# EAGLE design platform2 (EAGLE 6.4)
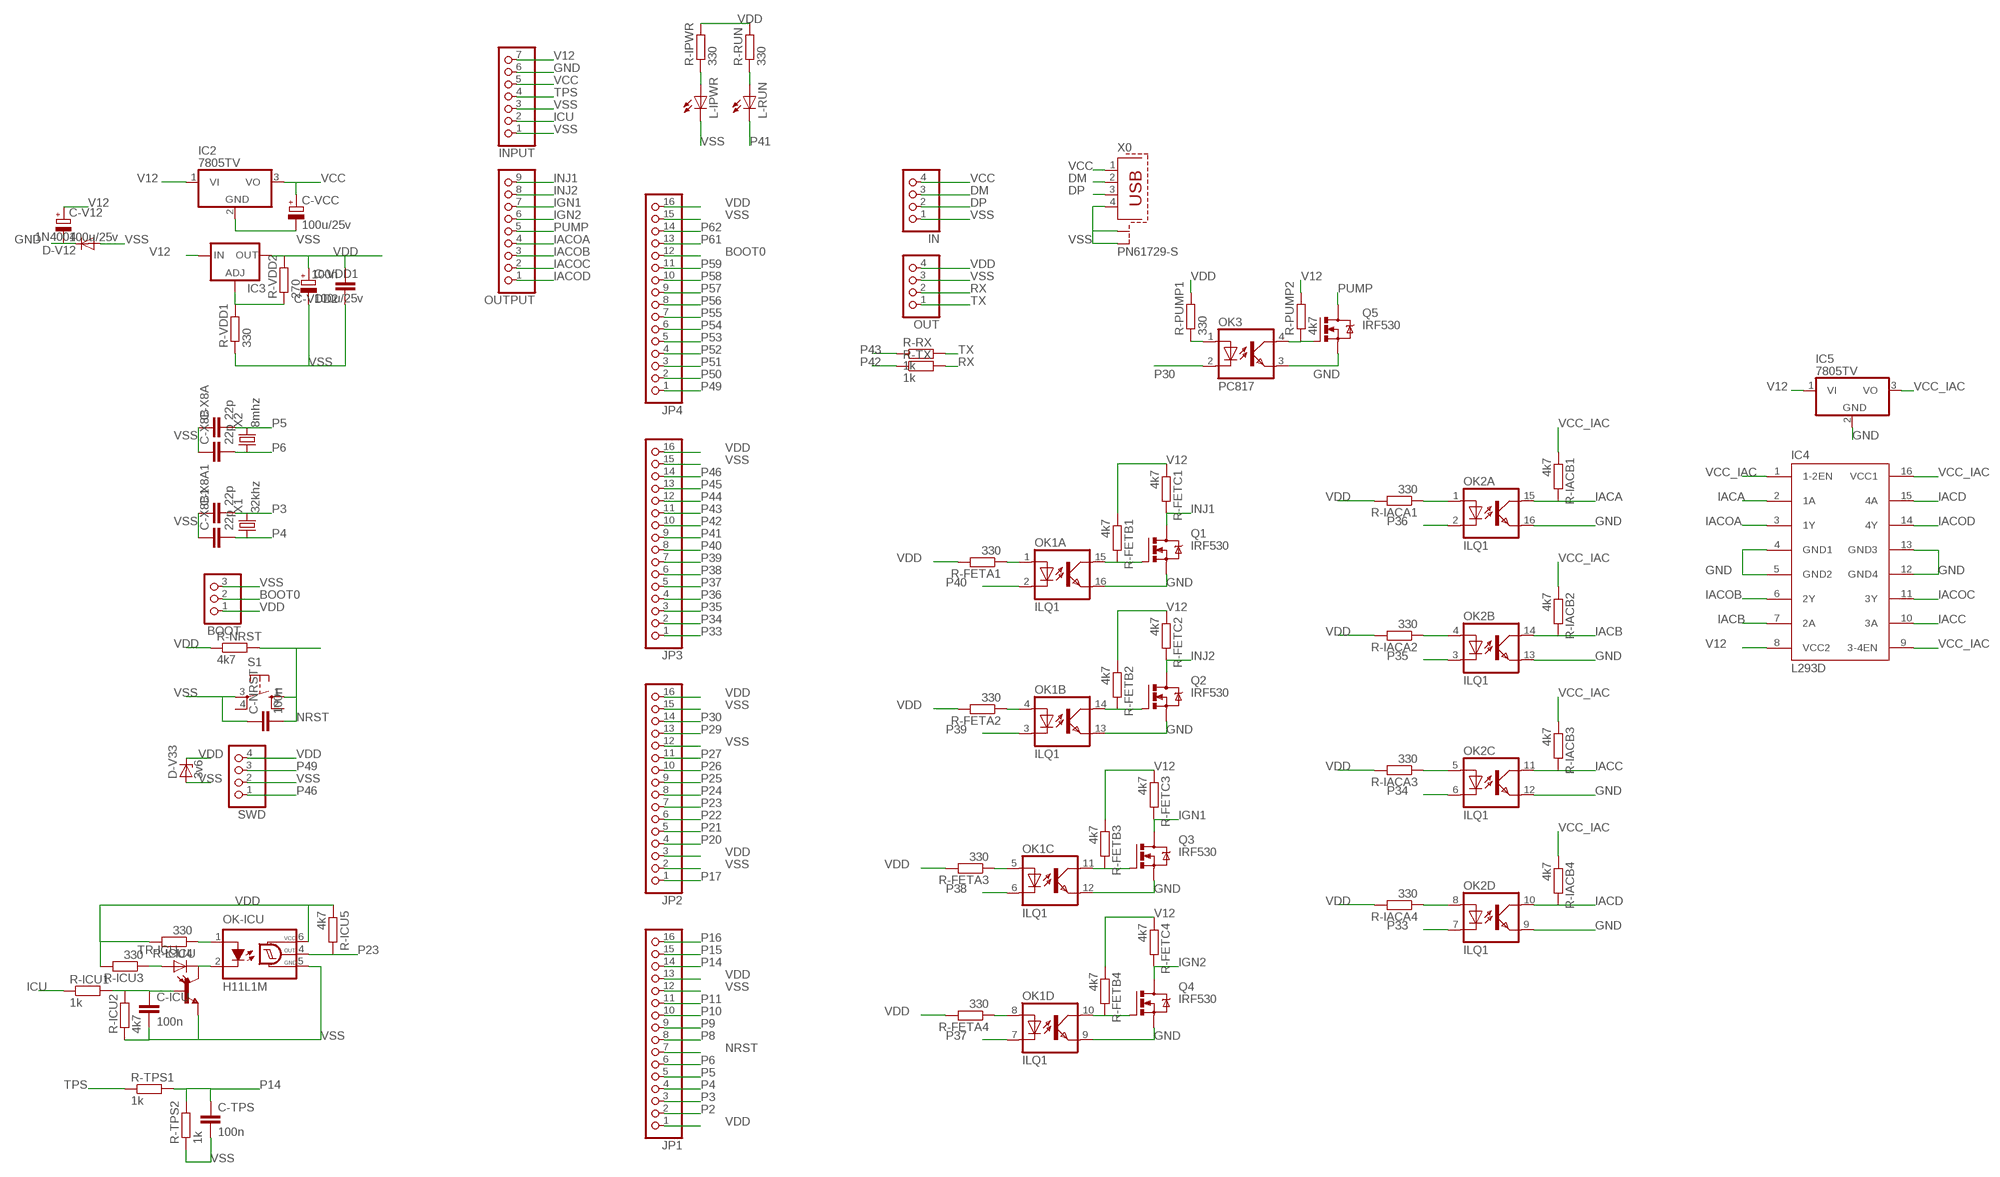
[diagram p0: schematic, sheet 1]

## Parts
BOOT  PINHD-1X3  [1X03]
C-ICU  100n  C-EU050-024X044  [C050-024X044]
C-NRST  100n  C-EU050-024X044  [C050-024X044]
C-TPS  100n  C-EU050-024X044  [C050-024X044]
C-V12  100u/25v  CPOL-EUE2-5  [E2-5]
C-VCC  100u/25v  CPOL-EUE2-5  [E2-5]
C-VDD1  100u/25v  CPOL-EUE2-5  [E2-5]
C-VDD2  100n  C-EU050-024X044  [C050-024X044]
C-X8A  22p  C-EU025-024X044  [C025-024X044]
C-X8A1  22p  C-EU025-024X044  [C025-024X044]
C-X8B  22p  C-EU025-024X044  [C025-024X044]
C-X8B1  22p  C-EU025-024X044  [C025-024X044]
D-V12  1N4004  [DO41-10]
D-V33  3v6  ZENER-DIODEZD-7.5  [ZDIO-7.5]
IC2  7805TV  [TO220V]
IC3  LM317TS  [317TS]
IC4  L293D  [DIL16]
IC5  7805TV  [TO220V]
IN  PINHD-1X4  [1X04]
INPUT  PINHD-1X7  [1X07]
JP1  PINHD-1X16  [1X16]
JP2  PINHD-1X16  [1X16]
JP3  PINHD-1X16  [1X16]
JP4  PINHD-1X16  [1X16]
L-ICU  LED3MM  [LED3MM]
L-IPWR  LED3MM  [LED3MM]
L-RUN  LED3MM  [LED3MM]
OK1  ILQ1  [DIL16]
OK2  ILQ1  [DIL16]
OK3  PC817  [DIL04]
OK-ICU  H11L1M  [DIL06]
OUT  PINHD-1X4  [1X04]
OUTPUT  PINHD-1X9  [1X09]
Q1  IRF530  [TO220BV]
Q2  IRF530  [TO220BV]
Q3  IRF530  [TO220BV]
Q4  IRF530  [TO220BV]
Q5  IRF530  [TO220BV]
R-FETA1  330  R-EU_0204/7  [0204/7]
R-FETA2  330  R-EU_0204/7  [0204/7]
R-FETA3  330  R-EU_0204/7  [0204/7]
R-FETA4  330  R-EU_0204/7  [0204/7]
R-FETB1  4k7  R-EU_0204/7  [0204/7]
R-FETB2  4k7  R-EU_0204/7  [0204/7]
R-FETB3  4k7  R-EU_0204/7  [0204/7]
R-FETB4  4k7  R-EU_0204/7  [0204/7]
R-FETC1  4k7  R-EU_0204/7  [0204/7]
R-FETC2  4k7  R-EU_0204/7  [0204/7]
R-FETC3  4k7  R-EU_0204/7  [0204/7]
R-FETC4  4k7  R-EU_0204/7  [0204/7]
R-IACA1  330  R-EU_0204/7  [0204/7]
R-IACA2  330  R-EU_0204/7  [0204/7]
R-IACA3  330  R-EU_0204/7  [0204/7]
R-IACA4  330  R-EU_0204/7  [0204/7]
R-IACB1  4k7  R-EU_0204/7  [0204/7]
R-IACB2  4k7  R-EU_0204/7  [0204/7]
R-IACB3  4k7  R-EU_0204/7  [0204/7]
R-IACB4  4k7  R-EU_0204/7  [0204/7]
R-ICU1  1k  R-EU_0204/7  [0204/7]
R-ICU2  4k7  R-EU_0204/7  [0204/7]
R-ICU3  330  R-EU_0204/7  [0204/7]
R-ICU4  330  R-EU_0204/7  [0204/7]
R-ICU5  4k7  R-EU_0204/7  [0204/7]
R-IPWR  330  R-EU_0204/7  [0204/7]
R-NRST  4k7  R-EU_0204/7  [0204/7]
R-PUMP1  330  R-EU_0204/7  [0204/7]
R-PUMP2  4k7  R-EU_0204/7  [0204/7]
R-RUN  330  R-EU_0204/7  [0204/7]
R-RX  1k  R-EU_0204/7  [0204/7]
R-TPS1  1k  R-EU_0204/7  [0204/7]
R-TPS2  1k  R-EU_0204/7  [0204/7]
R-TX  1k  R-EU_0204/7  [0204/7]
R-VDD1  330  R-EU_0204/7  [0204/7]
R-VDD2  270  R-EU_0204/7  [0204/7]
S1  10-XX  [B3F-10XX]
SWD  PINHD-1X4  [1X04]
TR-ICU  2N3904-NPN-TO92-EBC  [TO92-EBC]
X0  PN61729-S  [PN61729-S]
X1  32khz  CRYSTALTC26V  [TC26V]
X2  8mhz  CRYSTALHC49U-V  [HC49U-V]

## Nets
BOOT0: BOOT.2 JP4.12
DM: IN.3 X0.2
DP: IN.2 X0.3
GND: C-V12.- D-V12.C IC4.4(GND1) IC4.5(GND2) IC4.12(GND4) IC4.13(GND3) IC5.2(GND) INPUT.6 OK1.9(D:EMIT) OK1.12(C:EMIT) OK1.13(B:EMIT) OK1.16(A:EMIT) OK2.9(D:EMIT) OK2.12(C:EMIT) OK2.13(B:EMIT) OK2.16(A:EMIT) OK3.3(EMIT) Q1.S Q2.S Q3.S Q4.S Q5.S
IACA: IC4.2(1A) OK2.15(A:COL) R-IACB1.2
IACB: IC4.7(2A) OK2.14(B:COL) R-IACB2.2
IACC: IC4.10(3A) OK2.11(C:COL) R-IACB3.2
IACD: IC4.15(4A) OK2.10(D:COL) R-IACB4.2
IACOA: IC4.3(1Y) OUTPUT.4
IACOB: IC4.6(2Y) OUTPUT.3
IACOC: IC4.11(3Y) OUTPUT.2
IACOD: IC4.14(4Y) OUTPUT.1
ICU: INPUT.2 R-ICU1.1
IGN1: OUTPUT.7 Q3.D R-FETC3.2
IGN2: OUTPUT.6 Q4.D R-FETC4.2
INJ1: OUTPUT.9 Q1.D R-FETC1.2
INJ2: OUTPUT.8 Q2.D R-FETC2.2
N$2: OK1.14(B:COL) Q2.G R-FETB2.2
N$3: C-ICU.1 R-ICU1.2 R-ICU2.2 TR-ICU.B
N$4: L-ICU.K(C) OK-ICU.2(C) TR-ICU.C
N$5: OK-ICU.1(A) R-ICU4.1
N$6: L-ICU.A R-ICU3.1
N$7: L-IPWR.A R-IPWR.1
N$8: L-RUN.A R-RUN.1
N$9: OK3.1(A) R-PUMP1.1
N$10: OK2.1(A:A) R-IACA1.1
N$11: OK1.15(A:COL) Q1.G R-FETB1.2
N$12: OK1.4(B:A) R-FETA2.1
N$13: OK1.1(A:A) R-FETA1.1
N$14: OK1.11(C:COL) Q3.G R-FETB3.2
N$15: OK1.5(C:A) R-FETA3.1
N$16: OK1.10(D:COL) Q4.G R-FETB4.2
N$17: OK1.8(D:A) R-FETA4.1
N$18: OK2.4(B:A) R-IACA2.1
N$20: OK3.4(COL) Q5.G R-PUMP2.1
N$21: OK2.5(C:A) R-IACA3.1
N$22: OK2.8(D:A) R-IACA4.1
N$25: IC3.1(ADJ) R-VDD1.2 R-VDD2.1
NRST: C-NRST.2 JP1.7 R-NRST.2 S1.1(S)
P2: JP1.2
P3: C-X8A1.2 JP1.3 X1.2
P4: C-X8B1.2 JP1.4 X1.1
P5: C-X8A.2 JP1.5 X2.2
P6: C-X8B.2 JP1.6 X2.1
P8: JP1.8
P9: JP1.9
P10: JP1.10
P11: JP1.11
P14: C-TPS.1 JP1.14 R-TPS1.2 R-TPS2.2
P15: JP1.15
P16: JP1.16
P17: JP2.1
P20: JP2.4
P21: JP2.5
P22: JP2.6
P23: JP2.7 OK-ICU.4(OUT) R-ICU5.2
P24: JP2.8
P25: JP2.9
P26: JP2.10
P27: JP2.11
P29: JP2.13
P30: JP2.14 OK3.2(C)
P33: JP3.1 OK2.7(D:C)
P34: JP3.2 OK2.6(C:C)
P35: JP3.3 OK2.3(B:C)
P36: JP3.4 OK2.2(A:C)
P37: JP3.5 OK1.7(D:C)
P38: JP3.6 OK1.6(C:C)
P39: JP3.7 OK1.3(B:C)
P40: JP3.8 OK1.2(A:C)
P41: JP3.9 L-RUN.K(C)
P42: JP3.10 R-TX.1
P43: JP3.11 R-RX.1
P44: JP3.12
P45: JP3.13
P46: JP3.14 SWD.1
P49: JP4.1 SWD.3
P50: JP4.2
P51: JP4.3
P52: JP4.4
P53: JP4.5
P54: JP4.6
P55: JP4.7
P56: JP4.8
P57: JP4.9
P58: JP4.10
P59: JP4.11
P61: JP4.13
P62: JP4.14
PUMP: OUTPUT.5 Q5.D
RX: OUT.2 R-TX.2
TPS: INPUT.4 R-TPS1.1
TX: OUT.1 R-RX.2
V12: C-V12.+ IC2.1(VI) IC3.3(IN) IC4.8(VCC2) IC5.1(VI) INPUT.7 R-FETB1.1 R-FETB2.1 R-FETB3.1 R-FETB4.1 R-FETC1.1 R-FETC2.1 R-FETC3.1 R-FETC4.1 R-PUMP2.2
VCC: C-VCC.+ IC2.3(VO) IN.4 INPUT.5 X0.1
VCC_IAC: IC4.1(1-2EN) IC4.9(3-4EN) IC4.16(VCC1) IC5.3(VO) R-IACB1.1 R-IACB2.1 R-IACB3.1 R-IACB4.1
VDD: BOOT.1 C-VDD1.+ C-VDD2.2 D-V33.C IC3.2(OUT) JP1.1 JP1.13 JP2.3 JP2.16 JP3.16 JP4.16 OK-ICU.6(VCC) OUT.4 R-FETA1.2 R-FETA2.2 R-FETA3.2 R-FETA4.2 R-IACA1.2 R-IACA2.2 R-IACA3.2 R-IACA4.2 R-ICU3.2 R-ICU4.2 R-ICU5.1 R-IPWR.2 R-NRST.1 R-PUMP1.2 R-RUN.2 R-VDD2.2 SWD.4
VSS: BOOT.3 C-ICU.2 C-NRST.1 C-TPS.2 C-VCC.- C-VDD1.- C-VDD2.1 C-X8A1.1 C-X8A.1 C-X8B1.1 C-X8B.1 D-V12.A D-V33.A IC2.2(GND) IN.1 INPUT.1 INPUT.3 JP1.12 JP2.2 JP2.12 JP2.15 JP3.15 JP4.15 L-IPWR.K(C) OK-ICU.5(GND) OUT.3 R-ICU2.1 R-TPS2.1 R-VDD1.1 S1.3(P) SWD.2 TR-ICU.E X0.4 X0.S1 X0.S2
Unconnected: S1.2(S1) S1.4(P1)

## Library data of the parts
BOOT = pinhead:PINHD-1X3: PIN HEADER
C-ICU C-NRST C-TPS C-VDD2 C-X8A C-X8A1 C-X8B C-X8B1 = resistor:C-EU: CAPACITOR, European symbol
C-V12 C-VCC C-VDD1 = resistor:CPOL-EU: POLARIZED CAPACITOR, European symbol
D-V12 = diode:1N4004: DIODE general purpose rectifier, 1 A
D-V33 = diode:ZENER-DIODE: Z-Diode
IC2 IC5 = linear:78*: Positive VOLTAGE REGULATOR Source: http://cache.national.com/ds/LM/LM78L05.pdf http://www.fairchildsemi.com/ds/LM/LM7805.pdf
IC3 = v-reg:LM317TS: VOLTAGE REGULATOR
IC4 = st-microelectronics:L293D: PUSH-PULL 4 CHANNEL DRIVER; MPN: L293D; OC_FARNELL: 9589619; OC_NEWARK: 56P8249
IN OUT SWD = pinhead:PINHD-1X4: PIN HEADER
INPUT = pinhead:PINHD-1X7: PIN HEADER
JP1-JP4 = pinhead:PINHD-1X16: PIN HEADER
L-ICU L-IPWR L-RUN = led:LED: LED OSRAM: - CHIPLED LG R971, LG N971, LY N971, LG Q971, LY Q971, LO R971, LY R971 LH N974, LH R974 LS Q976, LO Q976, LY Q976 LO Q996 - Hyper CHIPLED LW Q18S LB Q993, LB Q99A, LB R99A - SideLED LS A670, LO A670, LY A670, LG A670, LP A670 LB A673, LV A673, LT A673, LW A673 LH A674 LY A675 LS A676, LA A676, LO A676, LY A676, LW A676 LS A679, LY A679, LG A679 - Hyper Micro SIDELED® LS Y876, LA Y876, LO Y876, LY Y876 LT Y87S - SmartLED LW L88C, LW L88S LB L89C, LB L89S, LG L890 LS L89K, LO L89K, LY L89K LS L896, LA L896, LO L896, LY L896 - TOPLED LS T670, LO T670, LY T670, LG T670, LP T670 LSG T670, LSP T670, LSY T670, LOP T670, LYG T670 LG T671, LOG T671, LSG T671 LB T673, LV T673, LT T673, LW T673 LH T674 LS T676, LA T676, LO T676, LY T676, LB T676, LH T676, LSB T676, LW T676 LB T67C, LV T67C, LT T67C, LS T67K, LO T67K, LY T67K, LW E67C LS E67B, LA E67B, LO E67B, LY E67B, LB E67C, LV E67C, LT E67C LW T67C LS T679, LY T679, LG T679 LS T770, LO T770, LY T770, LG T770, LP T770 LB T773, LV T773, LT T773, LW T773 LH T774 LS E675, LA E675, LY E675, LS T675 LS T776, LA T776, LO T776, LY T776, LB T776 LHGB T686 LT T68C, LB T68C - Hyper Mini TOPLED® LB M676 - Mini TOPLED Santana® LG M470 LS M47K, LO M47K, LY M47K Source: http://www.osram.convergy.de LUXEON: - LUMILED® LXK2-PW12-R00, LXK2-PW12-S00, LXK2-PW14-U00, LXK2-PW14-V00 LXK2-PM12-R00, LXK2-PM12-S00, LXK2-PM14-U00 LXK2-PE12-Q00, LXK2-PE12-R00, LXK2-PE12-S00, LXK2-PE14-T00, LXK2-PE14-U00 LXK2-PB12-K00, LXK2-PB12-L00, LXK2-PB12-M00, LXK2-PB14-N00, LXK2-PB14-P00, LXK2-PB14-Q00 LXK2-PR12-L00, LXK2-PR12-M00, LXK2-PR14-Q00, LXK2-PR14-R00 LXK2-PD12-Q00, LXK2-PD12-R00, LXK2-PD12-S00 LXK2-PH12-R00, LXK2-PH12-S00 LXK2-PL12-P00, LXK2-PL12-Q00, LXK2-PL12-R00 Source: www.luxeon.com KINGBRIGHT: KA-3528ASYC Source: www.kingbright.com
OK1 OK2 = optocoupler:ILQ1: SIEMENS OPTO COUPLER; MF: VISHAY/TELEFUNKEN; MPN: ILQ1; OC_FARNELL: 1469501; OC_NEWARK: 88K1954
OK3 = optocoupler:PC817: SHARP OPTO COUPLER; MPN: PC817X4J000F; OC_FARNELL: 9707727; OC_NEWARK: 97K7059
OK-ICU = optocoupler:H11L*M: 6-Pin DIP Optocoupler Source: http://www.fairchildsemi.com/ds/H1/H11L2-M.pdf; MF: FAIRCHILD SEMICONDUCTOR; MPN: H11L1-M; OC_FARNELL: 1021127; OC_NEWARK: 72K8643
OUTPUT = pinhead:PINHD-1X9: PIN HEADER
Q1-Q5 = transistor-power:IRF530: HEXFET Power MOSFET
R-FETA1-R-FETA4 R-FETB1-R-FETB4 R-FETC1-R-FETC4 R-IACA1-R-IACA4 R-IACB1-R-IACB4 R-ICU1-R-ICU5 R-IPWR R-NRST R-PUMP1 R-PUMP2 R-RUN R-RX R-TPS1 R-TPS2 R-TX R-VDD1 R-VDD2 = resistor:R-EU_: RESISTOR, European symbol
S1 = switch-omron:10-XX: OMRON SWITCH; MPN: B3F-1000; OC_FARNELL: 176432; OC_NEWARK: 36M3542
TR-ICU = transistor-neu-to92:*-NPN-: NPN Transistror
X0 = con-berg:PN61729-S: BERG USB connector; OC_FARNELL: unknown; OC_NEWARK: unknown
X1 = crystal:CRYSTAL: CRYSTAL; OC_FARNELL: unknown; OC_NEWARK: unknown
X2 = crystal:CRYSTAL: CRYSTAL; OC_FARNELL: 1666969; OC_NEWARK: unknown

## Board
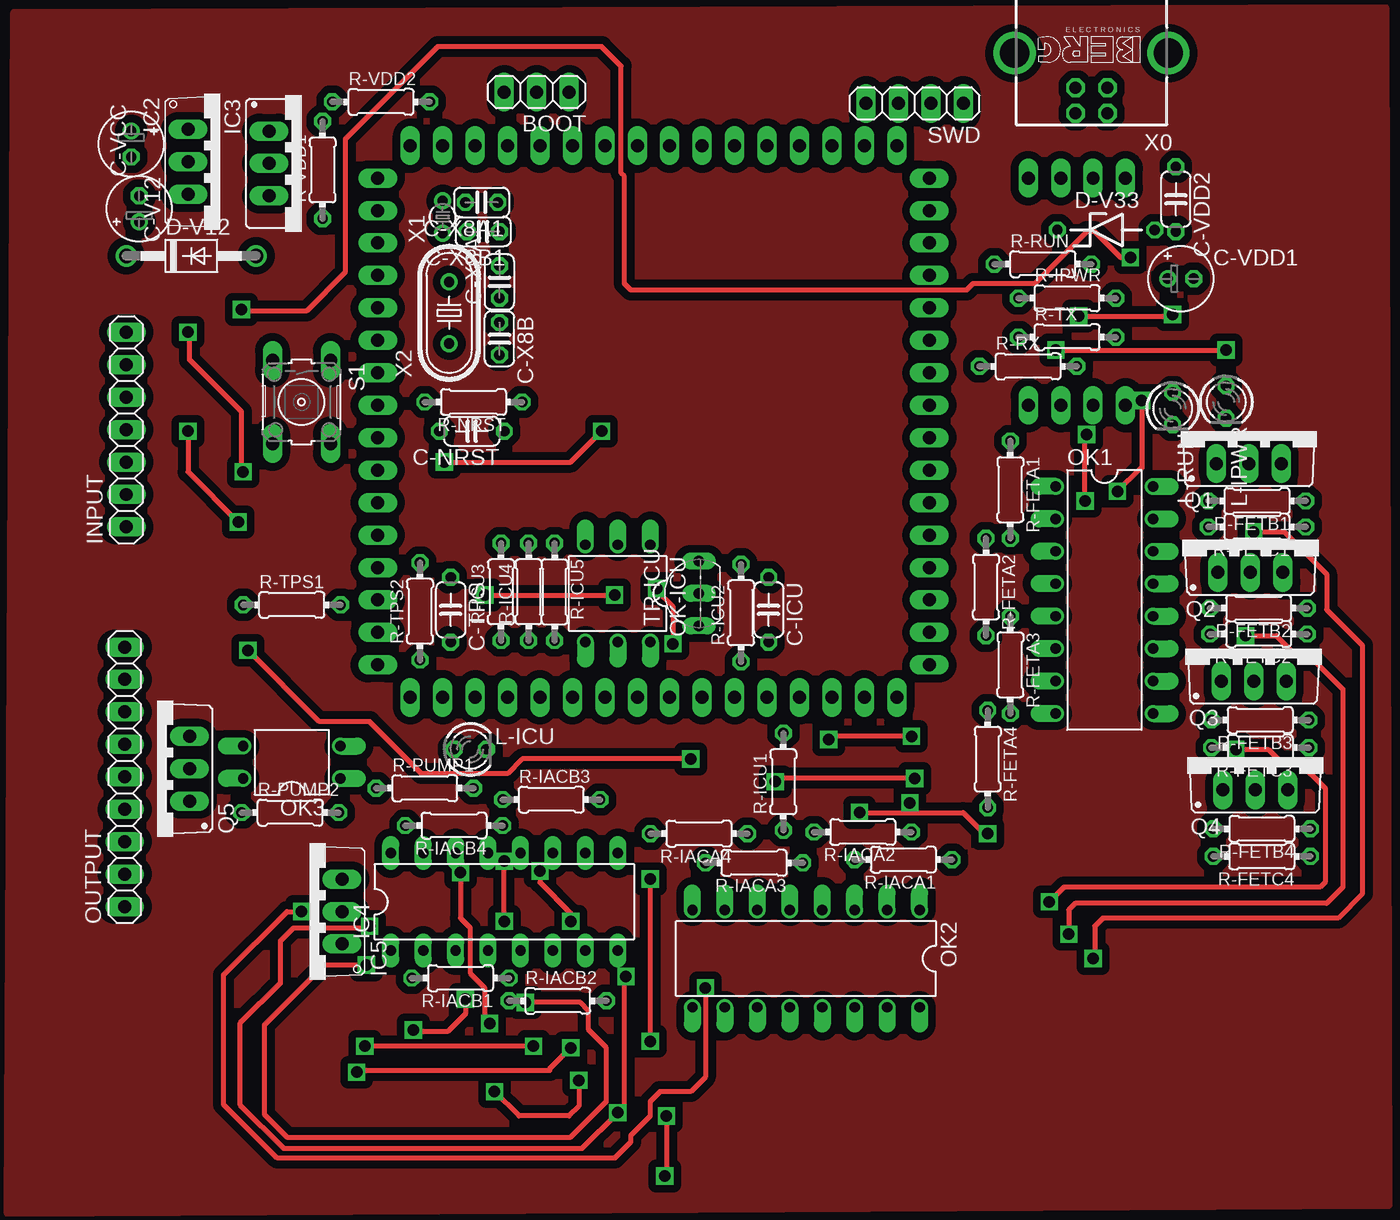
[diagram p1: board, top side]
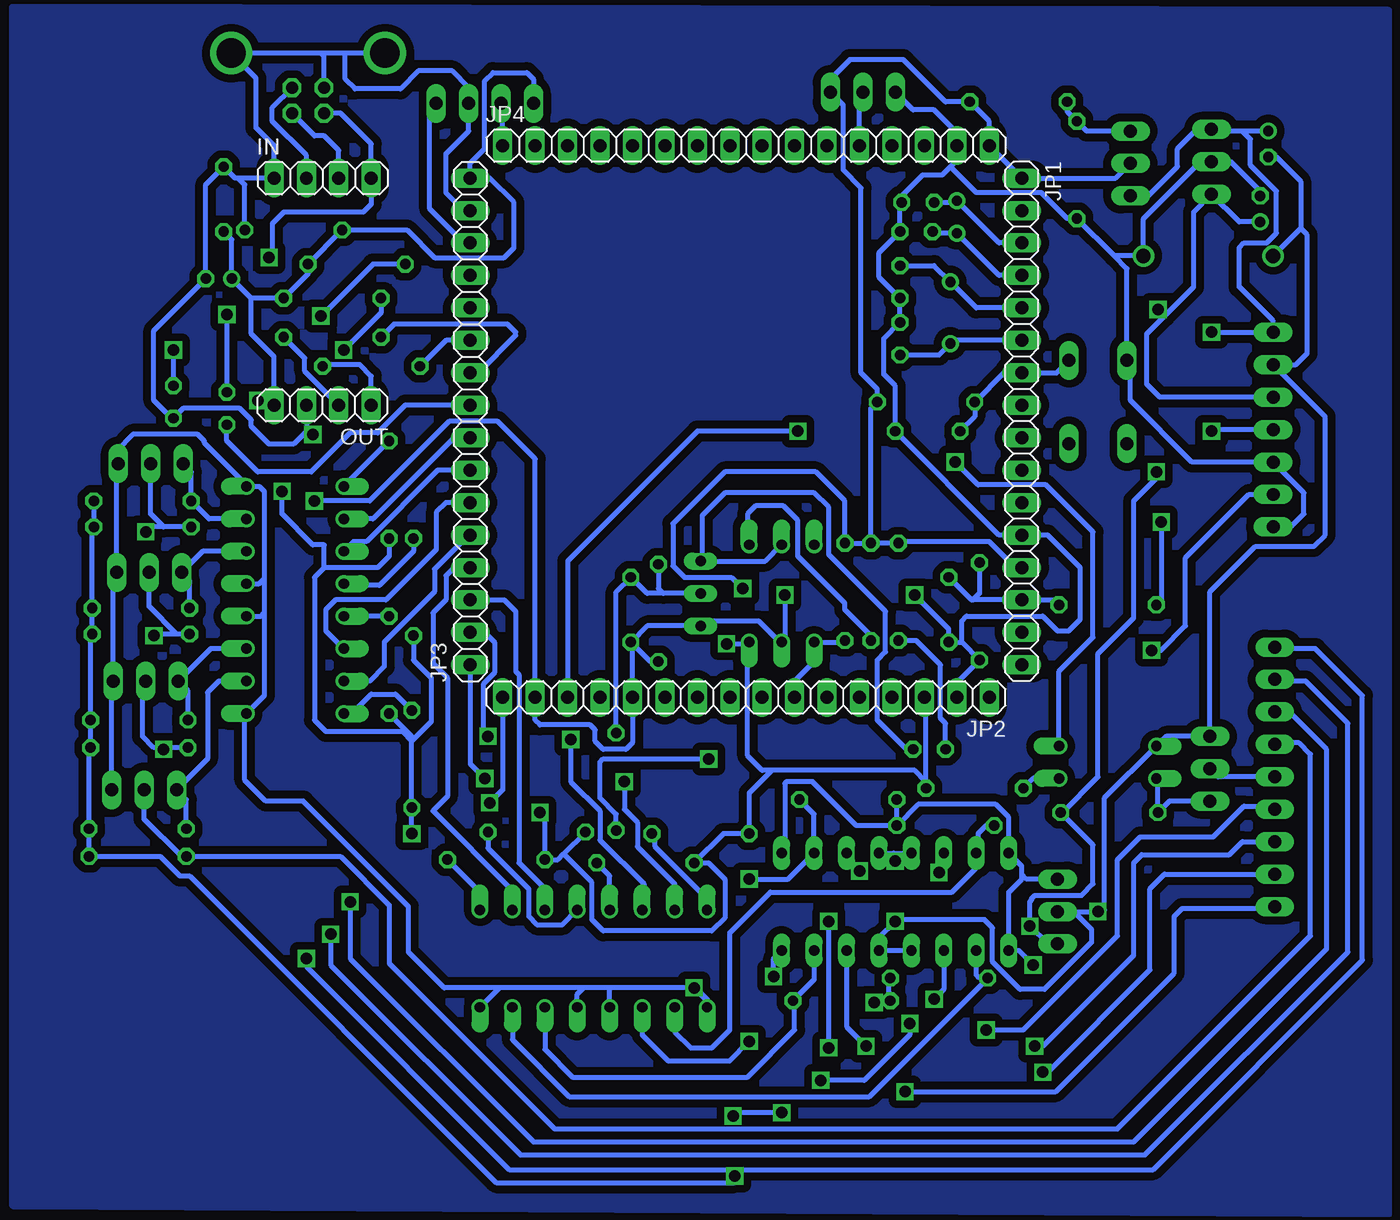
[diagram p2: board, bottom side, seen from below]

No outline drawn. Coordinates in mm, seen from the top.
Copper layers (1*16): Top 0.035mm / dielectric 1.5mm / Bottom 0.035mm
Design rules "default": minimum track width 10mil, minimum drill 24mil, track to track 8mil, track to pad 8mil, pad to pad 8mil, via to via 8mil, smd to smd 8mil, copper to edge 40mil, drill to drill 8mil, minimum pad ring 10mil, minimum via ring 8mil, stop-mask expansion 4mil, vias tented up to drill 0mil, thermal gap 10mil

### Footprints (pad centres in the part's own frame; a part is rotated, then mirrored left to right if it is on the bottom)
1X03 = drill 1.016 long: 1 -2.54,0; 2 0,0; 3 2.54,0
C050-024X044 = drill 0.813 octagon: 1 -2.54,0; 2 2.54,0
E2-5 = drill 0.813 pad 1.27: + -1.016,0 | drill 0.813 pad 1.27 octagon: - 1.016,0
C025-024X044 = drill 0.813 octagon: 1 -1.27,0; 2 1.27,0
DO41-10 = drill 1.118: A 5.08,0; C -5.08,0
ZDIO-7.5 = drill 0.813 octagon: A 3.81,0; C -3.81,0
TO220V = drill 1.016 long: 1 -2.54,-2.54; 2 0,-2.54; 3 2.54,-2.54
317TS = drill 1.016 long: 1 -2.54,-2.54; 2 0,-2.54; 3 2.54,-2.54
DIL16 = drill 0.813 long: 1 -8.89,-3.81; 2 -6.35,-3.81; 3 -3.81,-3.81; 4 -1.27,-3.81; 5 1.27,-3.81; 6 3.81,-3.81; 7 6.35,-3.81; 8 8.89,-3.81; 9 8.89,3.81; 10 6.35,3.81; 11 3.81,3.81; 12 1.27,3.81; 13 -1.27,3.81; 14 -3.81,3.81; 15 -6.35,3.81; 16 -8.89,3.81
1X04 = drill 1.016 long: 1 -3.81,0; 2 -1.27,0; 3 1.27,0; 4 3.81,0
1X07 = drill 1.016 long: 1 -7.62,0; 2 -5.08,0; 3 -2.54,0; 4 0,0; 5 2.54,0; 6 5.08,0; 7 7.62,0
1X16 = drill 1.016 long: 1 -19.05,0; 2 -16.51,0; 3 -13.97,0; 4 -11.43,0; 5 -8.89,0; 6 -6.35,0; 7 -3.81,0; 8 -1.27,0; 9 1.27,0; 10 3.81,0; 11 6.35,0; 12 8.89,0; 13 11.43,0; 14 13.97,0; 15 16.51,0; 16 19.05,0
LED3MM = drill 0.813 octagon: A -1.27,0; K 1.27,0
DIL16' = drill 0.813 offset: 1 -8.89,-3.81; 2 -6.35,-3.81; 3 -3.81,-3.81; 4 -1.27,-3.81; 5 1.27,-3.81; 6 3.81,-3.81; 7 6.35,-3.81; 8 8.89,-3.81; 9 8.89,3.81; 10 6.35,3.81; 11 3.81,3.81; 12 1.27,3.81; 13 -1.27,3.81; 14 -3.81,3.81; 15 -6.35,3.81; 16 -8.89,3.81
DIL04 = drill 0.813 offset: 1 -1.27,-3.81; 2 1.27,-3.81; 3 1.27,3.81; 4 -1.27,3.81
DIL06 = drill 0.813 offset: 1 -2.54,-3.81; 2 0,-3.81; 3 2.54,-3.81; 4 2.54,3.81; 5 0,3.81; 6 -2.54,3.81
1X09 = drill 1.016 long: 1 -10.16,0; 2 -7.62,0; 3 -5.08,0; 4 -2.54,0; 5 0,0; 6 2.54,0; 7 5.08,0; 8 7.62,0; 9 10.16,0
TO220BV = drill 1.016 long: D 0,-2.54; G -2.54,-2.54; S 2.54,-2.54
0204/7 = drill 0.813 octagon: 1 -3.81,0; 2 3.81,0
B3F-10XX = drill 1.016 long: 1 -3.251,2.261; 2 3.251,2.261; 3 -3.251,-2.261; 4 3.251,-2.261
TO92-EBC = drill 0.813 long: B 0,-1.27; C 2.54,-1.27; E -2.54,-1.27
PN61729-S = drill 0.95 octagon: 1 1.25,4.71; 2 -1.25,4.71; 3 -1.25,2.71; 4 1.25,2.71 | drill 2.3 pad 2.9: S1 -6.02,0; S2 6.02,0
TC26V = drill 0.813: 1 -1.27,0; 2 1.27,0
HC49U-V = drill 0.813: 1 -2.413,0; 2 2.413,0

### Placement (x,y rotation side)
BOOT  37.85,76.58 180 top
C-ICU  56.01,36.07 270 top
C-NRST  32.77,50.04 180 top
C-TPS  31.11,36.07 270 top
C-V12  6.1,72.52 270 top
C-VCC  6.73,67.44 90 top
C-VDD1  88.27,61.98 0 top
C-VDD2  87.88,68.2 270 top
C-X8A  34.92,61.72 90 top
C-X8A1  33.53,67.94 180 top
C-X8B  34.92,57.28 270 top
C-X8B1  33.66,65.66 180 top
D-V12  10.79,63.75 0 top
D-V33  82.42,65.79 0 top
IC2  13.08,71.12 270 top
IC3  19.43,70.99 270 top
IC4  35.31,13.21 0 top
IC5  20.07,12.45 90 top
IN  80.14,69.85 0 bottom
INPUT  5.71,50.16 90 top
JP1  25.4,50.8 270 bottom
JP2  46.99,29.21 180 bottom
JP3  68.58,50.8 90 bottom
JP4  46.99,72.39 0 bottom
L-ICU  32.64,25.15 0 top
L-IPWR  91.82,52.32 270 top
L-RUN  87.63,51.82 270 top
OK1  ILQ1  [DIL16']  82.3,36.83 270 top
OK2  ILQ1  [DIL16']  58.93,8.76 180 top
OK3  18.67,24.13 90 top
OK-ICU  44.2,37.34 180 top
OUT  80.14,52.07 180 bottom
OUTPUT  5.59,22.99 90 top
Q1  93.6,50.04 0 top
Q2  93.73,41.53 0 top
Q3  93.98,33.02 0 top
Q4  94.11,24.51 0 top
Q5  8.13,23.62 90 top
R-FETA1  74.93,45.47 270 top
R-FETA2  73.03,37.85 270 top
R-FETA3  74.93,31.75 270 top
R-FETA4  73.15,24.38 270 top
R-FETB1  94.23,44.58 180 top
R-FETB2  94.36,36.2 180 top
R-FETB3  94.49,27.43 180 top
R-FETB4  94.61,18.92 180 top
R-FETC1  94.23,42.55 180 top
R-FETC2  94.36,34.16 180 top
R-FETC3  94.49,25.27 180 top
R-FETC4  94.61,16.76 180 top
R-IACA1  66.55,16.51 180 top
R-IACA2  63.37,18.67 180 top
R-IACA3  54.86,16.26 180 top
R-IACA4  50.55,18.54 180 top
R-IACB1  31.88,7.24 180 top
R-IACB2  39.5,5.46 0 top
R-IACB3  38.99,21.21 0 top
R-IACB4  31.37,19.18 180 top
R-ICU1  57.15,22.61 90 top
R-ICU2  53.85,35.81 90 top
R-ICU3  35.05,37.47 90 top
R-ICU4  37.21,37.47 90 top
R-ICU5  39.24,37.47 270 top
R-IPWR  79.38,60.45 0 top
R-NRST  32.89,52.32 180 top
R-PUMP1  29.08,22.1 0 top
R-PUMP2  18.54,20.19 0 top
R-RUN  77.47,63.12 0 top
R-RX  76.33,55.12 0 top
R-TPS1  18.67,36.45 0 top
R-TPS2  28.7,35.94 90 top
R-TX  79.38,57.4 0 top
R-VDD1  21.08,70.48 90 top
R-VDD2  25.65,75.82 0 top
S1  19.43,52.32 270 top
SWD  67.44,75.69 180 top
TR-ICU  49.28,37.34 90 top
X0  81.28,79.63 180 top
X1  30.48,66.8 90 top
X2  30.99,59.31 90 top

### Tracks (layer width: path | path; a pad name or v marks a point on that pad's centre or on a via)
BOOT0
  Bottom 0.406: JP4.12 38.1,76.33 BOOT.2
DM
  Bottom 0.406: IN.3 78.87,72.01 80.01,73.15 80.76,73.15 X0.2
DP
  Bottom 0.406: IN.2 81.41,71.63 84.07,74.3 84.07,75.38 X0.3
GND  (via drill 0.9)
  Top 0.406: v35.31,11.68 v35.31,16.38 | v51.05,6.48 51.05,-0.51 49.91,-1.65 47.5,-1.65 46.74,-2.41 46.74,-3.56 45.21,-5.08 45.21,-5.59 43.94,-6.86 17.53,-6.86 13.34,-2.67 13.34,7.49 18.29,12.45 v19.43,12.45
  Bottom 0.406: Q4.S 96.65,30.35 Q3.S 96.52,38.73 Q2.S 96.27,47.37 Q1.S 96.27,47.62 96.27,48.51 95,49.78 89.92,49.78 89.41,49.28 89.41,49.15 86.11,45.85 OK1.16 85.09,45.72 84.71,45.34 84.71,38.48 | 84.71,38.48 84.71,35.81 | 84.71,35.81 84.71,29.34 OK1.9 86.23,27.81 86.23,22.73 84.58,21.08 81.66,21.08 73.41,12.83 73.41,9.27 70.61,6.48 66.29,6.48 | OK1.12 84.96,35.56 84.71,35.81 | OK1.13 85.09,38.1 84.71,38.48 | OK2.9 50.04,5.59 | 50.04,5.59 50.93,6.48 v51.05,6.48 | v51.05,6.48 57.53,6.48 | 57.53,6.48 59.69,6.48 | 59.69,6.48 66.29,6.48 | 66.29,6.48 OK2.16 | OK2.13 60.2,5.97 59.69,6.48 | OK2.12 57.66,6.35 57.53,6.48 | IC4.12 35.43,17.02 | 35.43,17.02 IC4.13 | IC4.4 IC4.5 36.58,10.41 v35.31,11.68 35.18,11.81 28.32,11.81 27.69,11.18 27.69,8.51 25.53,6.35 23.62,6.35 19.94,10.03 19.94,11.05 21.34,12.45 IC5.2 v19.43,12.45 19.05,12.45 18.92,12.57 18.92,21.34 OK3.3 14.1,26.16 Q5.S 10.67,37.47 7.11,41.02 2.54,41.02 1.65,41.91 1.65,51.18 INPUT.6 3.94,55.24 3.05,56.13 3.05,65.41 3.56,65.91 | v35.31,16.38 35.31,16.89 35.43,17.02 | 50.04,5.59 50.16,5.59 v51.05,6.48 | C-V12.- 5.46,71.5 3.56,69.6 3.56,65.91 | 3.56,65.91 D-V12.C
IACA
  Bottom 0.406: OK2.15 65.28,2.41 60.83,-2.03 37.34,-2.03 R-IACB1.2 28.7,7.24 28.96,7.49 IC4.2
IACB
  Bottom 0.406: OK2.14 62.74,1.65 60.58,-0.51 46.86,-0.51 43.18,3.17 43.18,5.33 R-IACB2.2 41.66,7.11 IC4.7
IACC  (via drill 0.9)
  Top 0.406: v46.74,2.29 v46.74,14.99
  Bottom 0.406: OK2.11 55.12,2.79 53.09,0.76 48.26,0.76 v46.74,2.29 | v46.74,14.99 43.69,14.99 IC4.10 41.66,20.07 R-IACB3.2
IACD
  Bottom 0.406: OK2.10 52.58,3.05 51.31,1.78 49.66,1.78 48.26,3.17 48.26,10.79 45.09,13.97 30.86,13.97 28.83,16 28.83,16.89 IC4.15 28.83,17.14 28.83,18.54 28.19,19.18 R-IACB4.2
IACOA  (via drill 0.9)
  Top 0.406: v32.26,5.59 32.26,4.45 30.86,3.05 28.32,3.05 v28.19,3.17
  Bottom 0.406: IC4.3 31.5,6.35 v32.26,5.59 | v28.19,3.17 25.27,3.17 17.91,10.54 17.91,16.51 16.13,18.29 10.41,18.29 8,20.7 5.84,20.7 OUTPUT.4
IACOB  (via drill 0.9)
  Top 0.406: v37.59,1.91 v24.38,1.91
  Bottom 0.406: IC4.6 39.12,3.43 v37.59,1.91 | v24.38,1.91 23.75,1.91 16.64,9.02 16.64,16.26 16,16.89 9.14,16.89 8.13,17.91 OUTPUT.3
IACOC  (via drill 0.9)
  Top 0.406: v38.1,15.62 38.1,14.73 40.51,12.32 v40.51,11.68 | v23.75,-0.13 23.88,0 38.86,0 38.86,0.13 v40.51,1.78
  Bottom 0.406: IC4.11 39.12,16.64 v38.1,15.62 | v23.75,-0.13 23.37,-0.13 15.37,7.87 15.37,14.22 14.22,15.37 OUTPUT.2 | v40.51,1.78 v40.51,11.68
IACOD  (via drill 0.9)
  Top 0.406: v31.88,15.49 31.88,11.94 32.64,11.18 32.64,7.62 33.78,6.48 33.78,4.06 v34.16,3.68 | v41.15,-0.76 41.15,-2.79 40.39,-3.56 36.45,-3.56 v34.54,-1.65
  Bottom 0.406: IC4.14 31.5,15.88 v31.88,15.49 | v34.16,3.68 34.16,2.79 37.72,-0.76 v41.15,-0.76 | v34.54,-1.65 22.73,-1.65 13.46,7.62 13.46,12.06 12.83,12.7 5.71,12.7 OUTPUT.1
ICU  (via drill 0.9)
  Top 0.406: v49.91,24.38 36.7,24.38 35.56,23.24 28.83,23.24 24.77,27.3 20.83,27.3 v15.24,32.89
  Bottom 0.406: R-ICU1.1 57.15,20.07 58.42,21.34 58.42,24.13 58.17,24.38 v49.91,24.38 | v15.24,32.89 14.48,32.89 12.57,34.8 12.57,40.13 7.62,45.09 INPUT.2
IGN1  (via drill 0.9)
  Top 0.406: v92.58,25.15 95.12,25.15 96.01,24.26 97.41,24.26 99.57,22.1 99.57,14.73 99.19,14.35 79.12,14.35 v77.98,13.21
  Bottom 0.406: Q3.D 94.23,30.23 94.23,26.16 93.34,25.27 R-FETC3.2 92.46,25.27 v92.58,25.15 | v77.98,13.21 77.98,8.76 63.63,-5.59 16.64,-5.59 1.52,9.53 1.52,25.15 4.57,28.19 5.46,28.19 OUTPUT.7
IGN2
  Bottom 0.406: Q4.D 94.11,19.68 91.19,16.76 R-FETC4.2 78.74,16.76 74.93,12.95 74.93,8.38 61.98,-4.57 17.91,-4.57 2.79,10.54 2.79,24.77 3.68,25.65 5.46,25.65 OUTPUT.6
INJ1  (via drill 0.9)
  Top 0.406: v93.98,42.16 96.39,42.16 99.69,38.86 99.69,36.07 102.49,33.27 102.49,13.84 100.58,11.94 82.17,11.94 81.53,11.3 81.53,8.89 v81.41,8.76
  Bottom 0.406: Q1.D 93.6,43.56 92.58,42.55 R-FETC1.2 93.6,42.55 v93.98,42.16 | v81.41,8.76 81.41,8.13 65.53,-7.75 15.11,-7.75 -1.27,8.64 -1.27,29.34 2.41,33.02 5.46,33.02 OUTPUT.9
INJ2  (via drill 0.9)
  Top 0.406: v93.34,34.04 95.76,34.04 97.28,32.51 98.3,32.51 100.97,29.84 100.97,14.35 99.69,13.08 80.01,13.08 79.5,12.57 v79.5,10.67
  Bottom 0.406: Q2.D 93.73,36.32 91.57,34.16 R-FETC2.2 93.22,34.16 v93.34,34.04 | v79.5,10.67 79.5,8.26 64.64,-6.6 15.75,-6.6 -0.13,9.27 -0.13,27.18 3.17,30.48 5.46,30.48 OUTPUT.8
N$1
  pour Bottom (isolate 0.61): -3.3,82.93 104.39,83.19 104.39,-10.54 -3.3,-11.18
  pour Top (isolate 0.61): -3.05,82.8 104.27,83.19 104.52,-10.54 -3.56,-11.18
N$2
  Bottom 0.406: OK1.14 89.53,40.64 Q2.G 90.55,38.35 R-FETB2.2
N$3
  Bottom 0.406: TR-ICU.B 53.47,37.34 | 53.47,37.34 54.74,37.34 C-ICU.1 57.15,37.47 R-ICU1.2 | R-ICU2.2 53.85,37.72 53.47,37.34
N$4
  Bottom 0.406: OK-ICU.2 45.47,39.88 TR-ICU.C 50.42,40.01 50.42,43.43 48.64,45.21 41.66,45.21 40.51,44.07 40.51,40.39 36.07,35.94 36.07,32.77 36.7,32.13 36.7,27.43 34.42,25.15 L-ICU.K
N$5
  Bottom 0.406: R-ICU4.1 37.21,34.04 39.24,36.07 39.24,36.58 42.93,40.26 42.93,43.05 44.07,44.2 46.23,44.2 46.86,43.56 46.86,41.27 OK-ICU.1
N$6
  Bottom 0.406: L-ICU.A 31.37,27.18 31.75,27.56 31.75,31.75 33.66,33.66 R-ICU3.1
N$7  (via drill 0.9)
  Top 0.406: v78.49,56.39 v91.82,56.39
  Bottom 0.406: R-IPWR.1 75.56,59.31 v78.49,56.39 | v91.82,56.39 L-IPWR.A
N$8  (via drill 0.9)
  Top 0.406: v80.26,59.05 87.5,59.05 v87.63,59.18
  Bottom 0.406: R-RUN.1 76.2,63.12 v80.26,59.05 | v87.63,59.18 L-RUN.A
N$9
  Bottom 0.406: OK3.1 24.51,22.86 R-PUMP1.1
N$10
  Bottom 0.406: OK2.1 67.82,13.97 R-IACA1.1
N$11
  Bottom 0.406: OK1.15 89.03,43.18 R-FETB1.2 90.42,46.86 Q1.G
N$12
  Bottom 0.406: R-FETA2.1 73.03,40.64 75.69,37.97 78.36,37.97 OK1.4
N$13
  Bottom 0.406: R-FETA1.1 OK1.1
N$14
  Bottom 0.406: OK1.11 88.9,33.02 Q3.G 90.68,29.72 R-FETB3.2
N$15
  Bottom 0.406: R-FETA3.1 OK1.5
N$16
  Bottom 0.406: OK1.10 88.27,30.48 89.15,29.59 89.15,24.38 Q4.G 90.81,21.21 R-FETB4.2
N$17
  Bottom 0.406: OK1.8 77.85,27.94 76.33,29.46 74.42,29.46 R-FETA4.1
N$18
  Bottom 0.406: R-IACA2.1 67.18,17.4 64.01,14.22 64.01,12.06 63.37,11.43 61.34,11.43 OK2.4
N$20
  Bottom 0.406: Q5.G 13.84,21.08 R-PUMP2.1 14.73,22.73 OK3.4
N$21
  Bottom 0.406: OK2.5 57.66,15.24 R-IACA3.1
N$22
  Bottom 0.406: OK2.8 50.04,13.46 54.1,17.53 54.1,18.29 R-IACA4.1
N$25
  Bottom 0.406: IC3.1 20.32,73.53 R-VDD1.2 21.84,75.06 R-VDD2.1
NRST
  Bottom 0.406: C-NRST.2 29.08,51.18 R-NRST.2 26.8,54.61 JP1.7 22.66,54.61 S1.1
P3
  Bottom 0.406: JP1.3 27.18,64.77 X1.2 30.61,67.94 C-X8A1.2
P4
  Bottom 0.406: JP1.4 27.18,62.23 X1.1 32.26,65.53 C-X8B1.2
P5
  Bottom 0.406: JP1.5 28.96,59.69 X2.2 32.26,62.99 C-X8A.2
P6
  Bottom 0.406: JP1.6 30.73,57.15 X2.1 31.88,56.01 C-X8B.2
P14
  Bottom 0.406: 29.21,36.83 JP1.14 22.86,36.83 R-TPS1.2 | 29.21,36.83 29.34,36.83 C-TPS.1 | R-TPS2.2 28.7,37.34 29.21,36.83
P23
  Bottom 0.406: R-ICU5.2 39.37,33.53 OK-ICU.4 41.66,32 43.18,30.48 JP2.7
P30  (via drill 0.9)
  Top 0.406: v30.61,47.62 40.51,47.62 v42.93,50.04
  Bottom 0.406: OK3.2 22.48,31.24 19.81,33.91 19.81,42.16 23.5,45.85 28.83,45.85 v30.61,47.62 | v42.93,50.04 50.8,50.04 60.96,39.88 JP2.14
P33  (via drill 0.9)
  Top 0.406: v67.44,22.86 56.77,22.86 v56.52,22.61
  Bottom 0.406: JP3.1 68.58,24 v67.44,22.86 | v56.52,22.61 56.52,20.45 55.5,19.43 55.5,17.53 52.58,14.61 OK2.7
P34  (via drill 0.9)
  Top 0.406: v67.18,26.16 60.96,26.16 v60.71,25.91
  Bottom 0.406: JP3.2 67.44,34.29 66.67,33.53 66.67,31.11 67.56,30.23 67.56,26.54 v67.18,26.16 | v60.71,25.91 60.71,22.61 58.42,20.32 58.42,18.03 54.99,14.61 54.99,12.7 OK2.6
P35
  Bottom 0.406: JP3.3 65.91,36.83 65.02,35.94 65.02,31.24 64.77,30.99 64.77,16.26 62.74,14.22 OK2.3
P36
  Bottom 0.406: JP3.4 69.85,39.37 70.48,38.73 70.48,36.83 71.5,35.81 71.5,31.88 70.36,30.73 70.36,21.46 71.5,20.32 65.41,14.22 65.41,12.7 OK2.2
P37
  Bottom 0.406: JP3.5 68.71,41.91 71.37,39.24 71.37,37.47 75.31,33.53 75.31,31.62 76.45,30.48 OK1.7
P38
  Bottom 0.406: JP3.6 70.48,44.45 71.25,43.69 71.25,40.77 75.18,36.83 79.12,36.83 79.88,36.07 79.88,34.42 OK1.6
P39
  Bottom 0.406: JP3.7 71.12,46.99 76.71,41.4 77.72,41.4 OK1.3
P40
  Bottom 0.406: JP3.8 69.85,49.53 76.2,43.18 OK1.2
P41
  Bottom 0.406: JP3.9 73.66,52.07 75.82,49.91 77.98,49.91 81.03,46.86 85.22,46.86 87.63,49.28 L-RUN.K
P42
  Bottom 0.406: JP3.10 67.94,54.61 65.02,57.53 65.02,57.78 65.66,58.42 74.55,58.42 R-TX.1
P43
  Bottom 0.406: JP3.11 70.48,57.15 R-RX.1
P46
  Bottom 0.406: JP3.14 69.09,64.77 71.75,67.44 71.75,75.18 SWD.1
P49
  Bottom 0.406: JP4.1 66.04,75.56 SWD.3
PUMP
  Bottom 0.406: OUTPUT.5 10.03,22.99 Q5.D
RX
  Bottom 0.406: OUT.2 81.53,54.74 81.53,55.75 R-TX.2
TPS  (via drill 0.9)
  Top 0.406: v10.54,50.04 10.54,46.86 v14.48,42.93
  Bottom 0.406: INPUT.4 10.41,50.16 v10.54,50.04 | v14.48,42.93 14.48,36.83 R-TPS1.1
TX
  Bottom 0.406: OUT.1 76.33,54.36 77.22,55.24 80.01,55.24 R-RX.2
V12  (via drill 0.9)
  Top 0.406: v44.83,7.37 44.7,7.24 44.7,-2.79 v44.2,-3.3 41.4,-6.1 18.03,-6.1 14.61,-2.67 14.61,3.68 17.78,6.86 17.78,10.16 18.8,11.18 24.64,11.18 v24.77,11.3 | v48.01,-3.56 48.01,-8.13 v47.88,-8.26 | v14.86,46.86 14.73,46.99 14.73,51.56 10.67,55.63 10.67,57.66 v10.54,57.78
  Bottom 0.406: R-FETB1.1 R-FETC1.1 98.17,42.42 R-FETB2.1 R-FETC2.1 98.3,34.04 R-FETB3.1 R-FETC3.1 98.42,25.15 R-FETB4.1 R-FETC4.1 92.84,16.76 91.31,15.24 90.55,15.24 66.55,-8.76 47.88,-8.76 v47.88,-8.26 | IC3.3 15.49,68.45 13.21,70.74 13.21,72.14 11.56,73.79 10.67,73.79 IC2.1 10.41,73.53 8.13,73.53 | C-V12.+ 8.13,73.53 | IC5.1 23.37,9.91 v24.77,11.3 24.77,13.21 24.64,13.34 24.64,13.46 24.38,13.72 20.7,13.72 19.81,14.61 19.81,17.65 R-PUMP2.2 22.23,20.19 19.43,22.99 19.43,32.64 16.64,35.43 16.64,44.58 14.86,46.35 v14.86,46.86 | v44.83,7.37 44.83,8.76 IC4.8 | v44.2,-3.3 47.88,-3.3 48.01,-3.43 v48.01,-3.56 | 8.13,73.53 7.49,72.9 7.49,70.87 5.46,68.83 5.46,65.53 6.22,64.77 8,64.77 8.38,64.39 8.38,61.34 5.71,58.67 INPUT.7 v10.54,57.78
VCC  (via drill 0.9)
  Top 0.406: v84.33,63.63 83.57,63.63 81.53,65.66 80.9,65.66 76.83,61.59 72.01,61.59 71.5,61.09 45.21,61.09 44.7,61.59 44.7,69.98 44.45,70.23 44.45,78.61 42.93,80.14 30.1,80.14 22.86,72.9 22.86,62.48 19.81,59.44 14.86,59.44 v14.73,59.56
  Bottom 0.406: X0.1 78.74,74.93 76.33,72.52 IN.4 76.33,67.82 76.96,67.18 83.19,67.18 84.07,66.29 84.07,63.88 v84.33,63.63 | C-VCC.+ 8.38,66.42 IC2.3 11.94,67.18 11.94,61.34 13.97,59.31 | INPUT.5 14.61,52.7 15.62,53.72 15.62,57.66 13.97,59.31 | v14.73,59.56 14.22,59.56 13.97,59.31
VCC_IAC  (via drill 0.9)
  Top 0.406: v24.51,8.26 21.21,8.26 16.51,3.56 16.51,-3.43 18.29,-5.21 40.51,-5.21 43.31,-2.41 43.31,1.78 41.91,3.17 41.91,4.7 41.27,5.33 v36.96,5.33
  Bottom 0.406: R-IACB1.1 35.81,7.11 35.81,6.1 35.69,5.97 R-IACB2.1 35.81,5.33 v36.96,5.33 | R-IACB4.1 R-IACB3.1 | R-IACB4.1 38.35,19.18 41.78,22.61 43.81,22.61 43.94,22.48 43.94,17.27 IC4.9 | R-IACB4.1 33.53,20.83 27.43,20.83 26.42,19.81 IC4.16 25.4,16 25.4,15.37 | 25.4,15.37 25.4,14.99 26.42,13.97 IC4.1 25.65,9.4 v24.51,8.26 | IC5.3 25.02,14.99 25.4,15.37
VDD  (via drill 0.9)
  Top 0.406: v47.24,37.72 47.24,37.59 48.51,36.32 v48.51,33.4 | v63.12,20.19 67.06,20.19 | 67.06,20.19 71.25,20.19 72.9,18.54 v73.15,18.54 | v67.06,20.95 67.06,20.19 | v85.22,52.45 85.22,47.12 85.09,47.12 v83.31,45.34
  Bottom 0.406: R-ICU4.2 R-ICU3.2 34.92,41.4 27.94,41.4 25.91,39.37 JP1.13 | R-ICU4.2 R-ICU5.1 39.24,44.58 41.53,46.86 48.64,46.86 52.7,42.8 52.7,39.5 51.82,38.61 48.13,38.61 v47.24,37.72 | R-ICU4.2 37.21,51.82 R-NRST.1 36.7,53.34 37.97,54.61 37.97,69.09 39.37,70.48 39.37,75.56 BOOT.1 40.39,77.6 38.86,79.12 34.67,79.12 31.37,75.82 R-VDD2.2 27.94,74.3 JP4.16 JP1.1 18.03,69.85 IC3.2 | SWD.4 63.63,77.6 64.14,78.11 66.8,78.11 67.44,77.47 67.44,72.14 68.58,70.99 JP3.16 67.06,69.85 65.15,67.94 65.15,64.39 65.91,63.63 71.37,63.63 73.53,65.79 D-V33.C R-RUN.2 81.28,62.36 R-IPWR.2 85.72,60.45 | C-VDD2.2 87.25,65.02 C-VDD1.+ 85.72,60.45 | 85.72,60.45 85.72,57.66 83.95,55.88 OUT.4 84.45,52.07 84.84,52.45 v85.22,52.45 | 61.28,16.95 61.72,16.51 R-IACA1.2 62.74,19.81 v63.12,20.19 | 61.28,16.95 R-IACA2.2 | 61.28,16.95 59.05,14.73 59.05,11.81 58.17,10.92 49.66,10.92 48.64,11.94 48.64,14.99 49.91,16.26 R-IACA3.2 48.77,18.54 R-IACA4.2 46.74,21.72 44.96,23.5 | JP2.3 32.89,29.08 R-PUMP1.2 32.89,22.61 33.78,23.5 44.96,23.5 | v48.51,33.4 46.86,33.4 | 73.15,25.78 R-FETA4.2 v73.15,18.54 | 73.15,25.78 73.15,26.16 R-FETA3.2 | JP2.16 66.04,21.97 v67.06,20.95 | R-FETA2.2 73.03,32.13 71.63,30.73 71.63,27.3 73.15,25.78 | R-FETA1.2 74.93,40.26 75.82,39.37 80.01,39.37 | 80.01,39.37 80.77,38.61 80.77,27.43 79.88,26.54 73.91,26.54 73.15,25.78 | 80.01,39.37 80.01,41.15 80.9,41.15 83.31,43.56 v83.31,45.34 | 44.96,23.5 45.72,23.5 46.86,24.64 46.86,33.4 | 46.86,33.4 OK-ICU.6
VSS  (via drill 0.9)
  Top 0.406: v80.77,44.58 80.77,49.66 v80.9,49.78 | v33.78,37.21 v43.94,37.21
  Bottom 0.406: JP2.2 30.48,30.35 R-TPS2.1 30.1,33.53 | 30.1,33.53 C-TPS.2 31.11,34.54 v33.78,37.21 | R-ICU2.1 54.48,32 C-ICU.2 | C-ICU.2 55.88,33.4 JP2.12 55.88,25.65 56.39,25.15 58.17,25.15 58.8,25.78 58.8,26.67 59.18,27.05 63.12,27.05 63.5,27.43 JP2.15 63.5,47.88 66.42,50.8 70.23,50.8 76.45,44.58 v80.77,44.58 | C-ICU.2 54.74,34.8 TR-ICU.E 50.16,35.18 45.97,35.18 44.32,33.53 OK-ICU.5 43.94,33.78 v43.94,37.21 | 30.99,70.74 31.62,70.1 33.15,70.1 34.8,68.45 C-X8A1.1 34.92,67.82 C-X8B1.1 36.58,64.01 36.58,62.1 C-X8A.1 C-X8B.1 36.2,57.28 36.2,54.48 35.31,53.59 C-NRST.1 27.18,41.91 JP1.12 23.37,41.91 20.83,39.37 20.83,35.31 21.72,34.42 22.61,34.42 23.75,35.56 29.72,35.56 30.1,35.18 30.1,33.53 | 30.99,70.74 30.48,71.25 JP4.15 30.48,73.41 32.26,75.18 33.91,75.18 BOOT.3 | JP3.15 69.09,67.31 70.48,68.71 70.48,71.75 68.71,73.53 SWD.2 68.71,76.96 69.98,78.23 72.64,78.23 74.04,76.83 77.6,76.83 78.36,77.6 78.36,79.63 | 86.74,69.85 IN.1 83.95,72.39 85.34,73.79 85.34,77.67 X0.S1 80.26,79.63 | 86.74,69.85 87,69.85 C-VDD2.1 89.28,69.34 C-VDD1.- 93.34,57.91 93.34,52.45 91.95,51.05 L-IPWR.K 91.06,51.82 86.61,51.82 85.72,50.93 85.72,50.42 84.33,49.02 82.42,49.02 81.41,50.04 | X0.S2 78.36,79.63 | 78.36,79.63 80.26,79.63 | X0.4 80.03,79.39 80.26,79.63 | D-V33.A 86.23,69.34 86.74,69.85 | OUT.3 81.41,50.04 | 18.16,63.75 D-V12.A 15.88,66.67 11.43,71.12 IC2.2 9.02,71.12 6.73,68.83 C-VCC.- | 18.16,63.75 R-VDD1.1 21.84,66.67 23.88,68.71 28.96,68.71 30.99,70.74 | 18.16,63.75 17.17,62.76 S1.3 16.89,55.3 16.89,52.45 12.06,47.62 INPUT.3 3.3,45.21 3.3,43.56 4.32,42.55 INPUT.1
  Bottom 0.406: v80.9,49.78 81.15,49.78 81.41,50.04